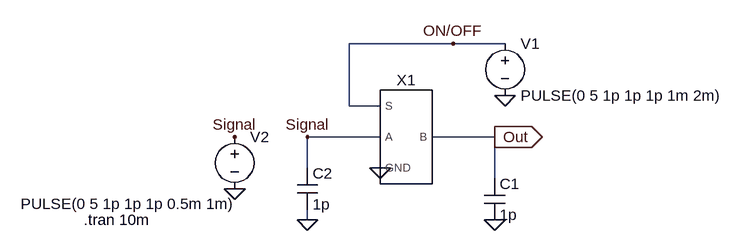
[diagram p0: schematic nmos passgate test.asc]
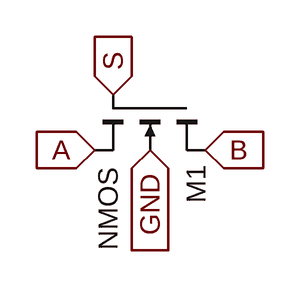
[diagram p1: sub-circuit nmos_single_switch.asc]
nmos passgate test.asc, the LTspice schematic file:
Version 4
SHEET 1 880 680
WIRE 288 0 128 0
WIRE 368 0 288 0
WIRE 128 96 128 0
WIRE 176 96 128 96
WIRE 176 144 64 144
WIRE 352 144 256 144
WIRE 64 192 64 144
WIRE 352 208 352 144
WIRE 64 272 64 256
FLAG 176 192 0
FLAG 368 80 0
FLAG -48 224 0
FLAG 288 0 ON/OFF
FLAG 352 272 0
FLAG 64 272 0
FLAG -48 144 Signal
FLAG 352 144 Out
IOPIN 352 144 Out
FLAG 64 144 Signal
SYMBOL voltage 368 -16 R0
WINDOW 123 0 0 Left 0
WINDOW 39 0 0 Left 0
SYMATTR InstName V1
SYMATTR Value PULSE(0 5 1p 1p 1p 1m 2m)
SYMBOL voltage -48 128 R0
WINDOW 3 -329 119 Left 2
WINDOW 123 0 0 Left 0
WINDOW 39 0 0 Left 0
SYMATTR Value PULSE(0 5 1p 1p 1p 0.5m 1m)
SYMATTR InstName V2
SYMBOL cap 336 208 R0
SYMATTR InstName C1
SYMATTR Value 1p
SYMBOL cap 48 192 R0
SYMATTR InstName C2
SYMATTR Value 1p
SYMBOL nmos_single_switch 208 144 R0
SYMATTR InstName X1
TEXT -280 272 Left 2 !.tran 10m

nmos_single_switch.asc, the sub-circuit schematic file:
Version 4
SHEET 1 880 680
FLAG 160 144 S
IOPIN 160 144 In
FLAG 144 192 A
IOPIN 144 192 In
FLAG 240 192 B
IOPIN 240 192 In
FLAG 192 192 GND
IOPIN 192 192 In
SYMBOL nmos4 240 144 R90
WINDOW 0 61 8 Left 2
WINDOW 3 63 84 Left 2
SYMATTR InstName M1

The netlist it stands for:
* nmos passgate test.asc
V1 ON/OFF 0 PULSE(0 5 1p 1p 1p 1m 2m)
V2 Signal 0 PULSE(0 5 1p 1p 1p 0.5m 1m)
C1 Out 0 1p
C2 Signal 0 1p
XX1 Signal Out 0 ON/OFF nmos_single_switch

* block symbol definitions
.subckt nmos_single_switch A B GND S
M1 B S A GND NMOS
.ends nmos_single_switch

.model NMOS NMOS
.model PMOS PMOS
.lib standard.mos
.tran 10m
.backanno
.end